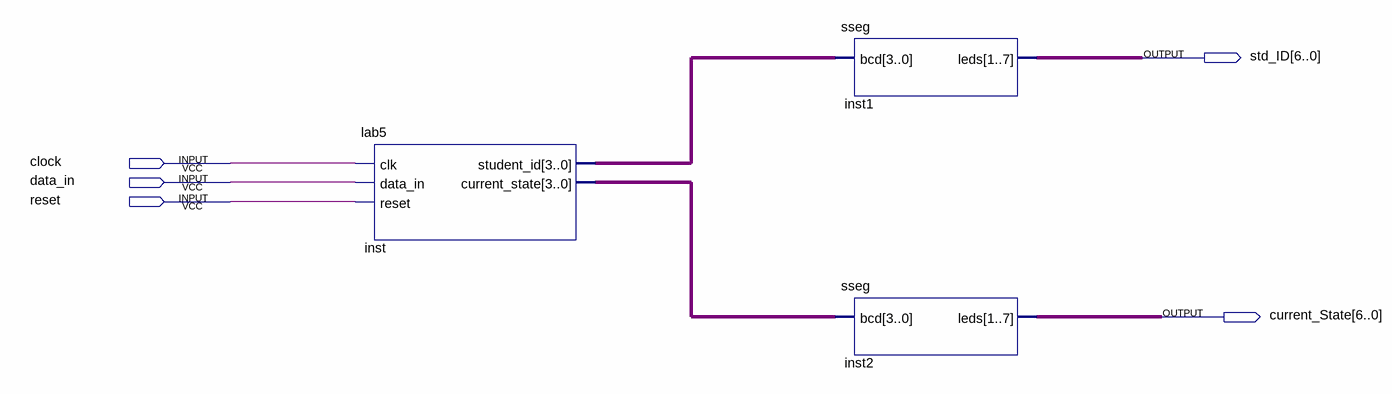
[diagram p0: schematic sheet]
// Quartus schematic lab5Combined.bdf as structural Verilog: 3 symbols, 5 pins
module lab5Combined (
  input  clock,
  input  data_in,
  input  reset,
  output [6:0] std_ID,
  output [6:0] current_State
);

  wire [3:0] inst_current_state, inst_student_id;

  lab5 inst (
    .clk(clock), .data_in(data_in), .reset(reset), .student_id(inst_student_id),
    .current_state(inst_current_state));
  sseg inst1 (.bcd(inst_student_id), .leds(std_ID));
  sseg inst2 (.bcd(inst_current_state), .leds(current_State));
endmodule
